# EAGLE design DOG_DisplayBreakout (EAGLE 7.3.0)
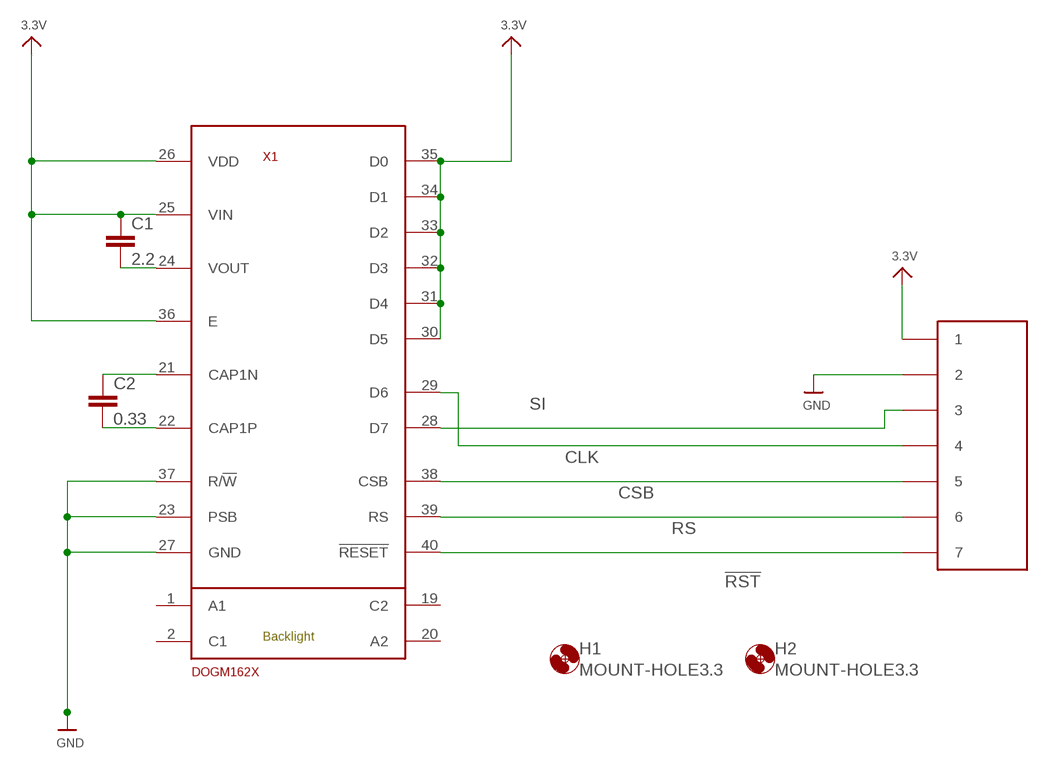
[diagram p0: schematic, sheet 1]

## Parts
C1  2.2  CAPACITOR0805  [0805_BIGGERPAD-OK]
C2  0.33  CAPACITOR0805  [0805_BIGGERPAD-OK]
CN1  JST_S7B-PH-K-S  [JST_S7B-PH-K-S]
H1  MOUNT-HOLE3.3  [HOLE3,3]
H2  MOUNT-HOLE3.3  [HOLE3,3]
X1  DOGM162X  [DOGM162X]

## Nets
3.3V: C1.1 CN1.P1 X1.25(VIN) X1.26(VDD) X1.30(D5) X1.31(D4) X1.32(D3) X1.33(D2) X1.34(D1) X1.35(D0) X1.36(E)
!RST: CN1.P7 X1.40(!RESET)
CLK: CN1.P4 X1.29(D6)
CSB: CN1.P5 X1.38(CSB)
GND: CN1.P2 X1.23(PSB) X1.27(GND) X1.37(R/!W)
N$1: C1.2 X1.24(VOUT)
N$2: C2.1 X1.21(CAP1N)
N$3: C2.2 X1.22(CAP1P)
RS: CN1.P6 X1.39(RS)
SI: CN1.P3 X1.28(D7)
Unconnected: X1.1(A1) X1.2(C1) X1.19(C2) X1.20(A2)

## Library data of the parts
C1 C2 = DMF-Bigger_SMD_footprints:CAPACITOR: Capacitor Standard 0603 ceramic capacitor, and 0.1" leaded capacitor.
CN1 = DMF-Additional_Supply_dmf:JST_S7B-PH-K-S
H1 H2 = DMF-Audio_Connectors:MOUNT-HOLE: MOUNTING HOLE with drill center marker
X1 = DMF_Displays:DOGM162X: DOGM Character Display http://www.lcd-module.com/products/dog.html

## Board
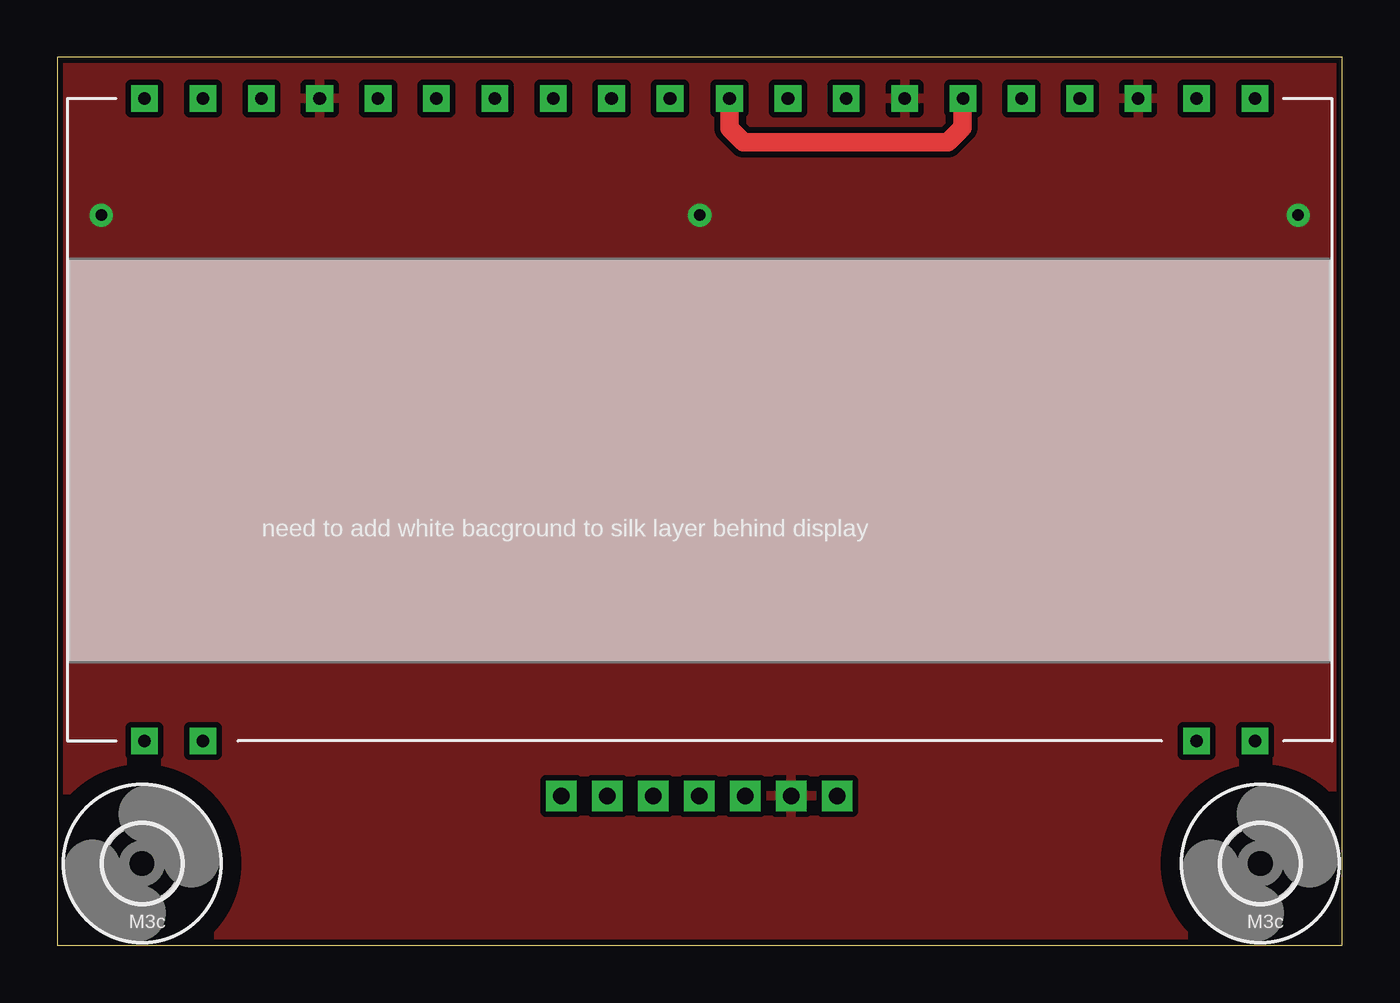
[diagram p1: board, top side]
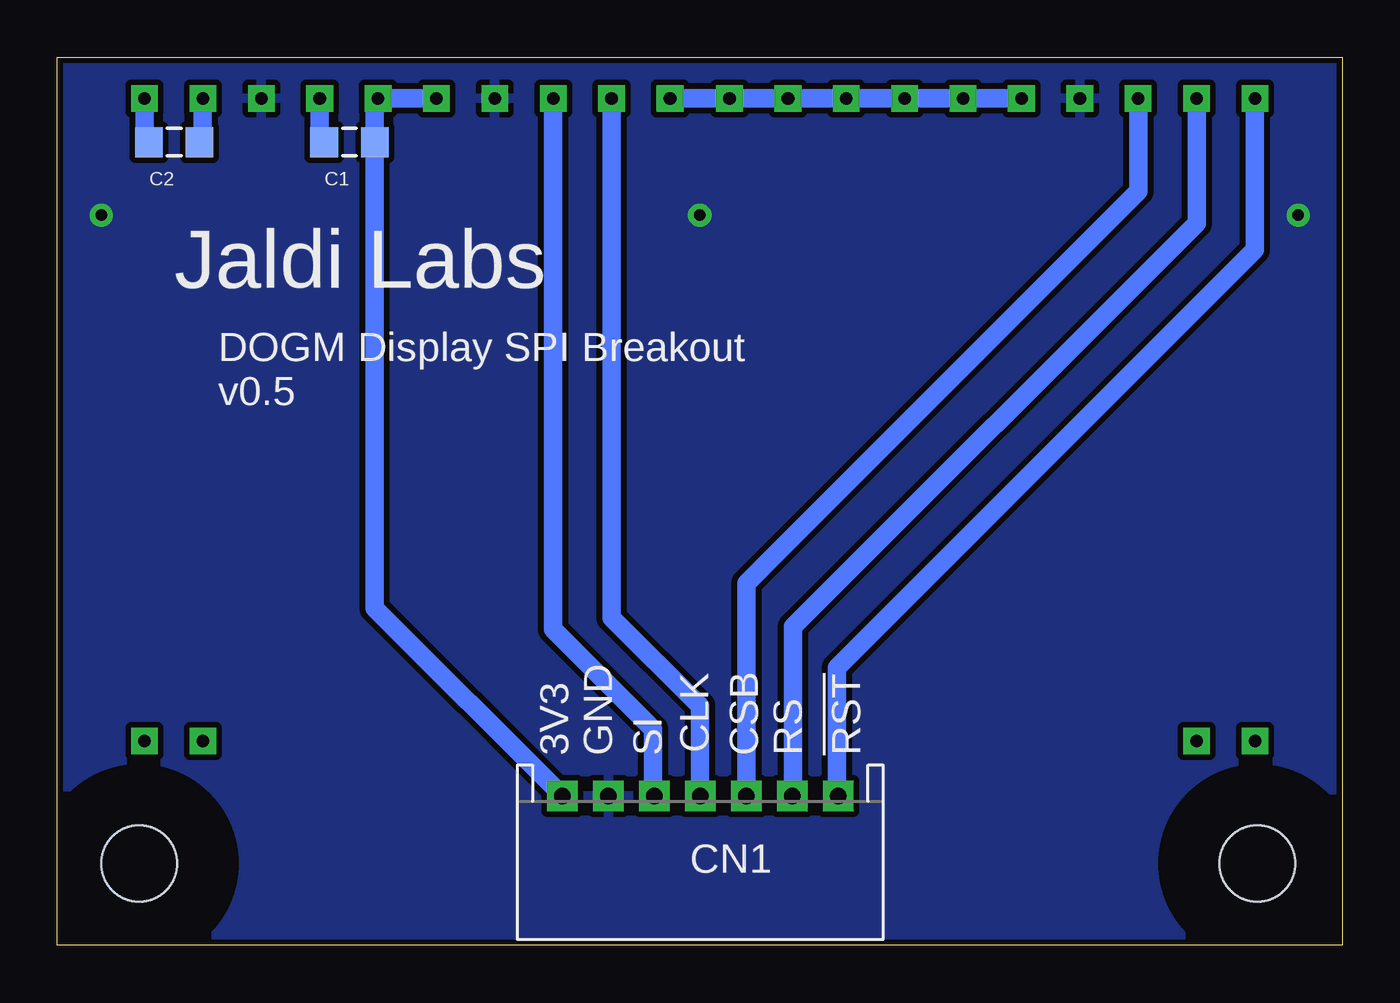
[diagram p2: board, bottom side, seen from below]

Size 55.88 x 38.61 mm. Coordinates in mm from the lower left corner, seen from the top.
Outline: 0,0 55.88,0 55.88,38.61 0,38.61 0,0
Copper layers (1*16): Top 0.035mm / dielectric 1.5mm / Bottom 0.035mm
Design rules "SparkFun-2-layer": minimum track width 7mil, minimum drill 15mil, track to track 8mil, track to pad 8mil, pad to pad 8mil, via to via 8mil, smd to smd 8mil, copper to edge 8mil, drill to drill 8mil, minimum pad ring 12mil, minimum via ring 10mil, stop-mask expansion 4mil, vias tented up to drill 20mil, thermal gap 10mil

### Footprints (pad centres in the part's own frame; a part is rotated, then mirrored left to right if it is on the bottom)
0805_BIGGERPAD-OK = smd 1.2 x 1.3: 1 -1.1,0; 2 1.1,0
JST_S7B-PH-K-S = drill 0.7 square: P1 1.96,6.24; P2 3.96,6.24; P3 5.96,6.24; P4 7.96,6.24; P5 9.96,6.24; P6 11.96,6.24; P7 13.96,6.24
HOLE3,3 = hole 3.3: 0,0
DOGM162X = drill 0.55 square: 1 -24.155,-13.97; 2 -21.615,-13.97; 19 21.615,-13.97; 20 24.155,-13.97; 21 24.155,13.97; 22 21.615,13.97; 23 19.075,13.97; 24 16.535,13.97; 25 13.995,13.97; 26 11.455,13.97; 27 8.915,13.97; 28 6.375,13.97; 29 3.835,13.97; 30 1.295,13.97; 31 -1.295,13.97; 32 -3.835,13.97; 33 -6.375,13.97; 34 -8.915,13.97; 35 -11.455,13.97; 36 -13.995,13.97; 37 -16.535,13.97; 38 -19.075,13.97; 39 -21.615,13.97; 40 -24.155,13.97

### Placement (x,y rotation side)
C1  43.18,34.92 180 bottom
C2  50.8,34.92 0 bottom
CN1  35.88,0.25 0 bottom
H1  3.68,3.56 0 top
H2  52.32,3.56 0 top
X1  27.94,22.86 0 top

### Tracks (layer width: path | path; a pad name or v marks a point on that pad's centre or on a via)
3.3V
  Top 0.813: 42.08,36.69 X1.25 | X1.30 29.23,35.53 29.84,34.92 38.73,34.92 39.37,35.56 39.37,36.8 X1.26
  Bottom 0.813: X1.30 X1.31 X1.32 X1.33 X1.34 X1.35 X1.36 | X1.26 X1.25 42.08,36.69 C1.1 42.08,14.66 CN1.P1
!RST
  Bottom 0.813: X1.40 3.79,30.25 21.97,12.06 21.97,6.55 CN1.P7
CLK
  Bottom 0.813: X1.29 31.77,14.25 27.94,10.41 27.94,6.52 CN1.P4
CSB
  Bottom 0.813: X1.38 8.87,32.79 25.91,15.75 25.91,6.5 CN1.P5
GND  (via drill 0.5)
  other vias: 27.94,31.75 53.98,31.75 1.91,31.75
  pour Bottom (isolate 0.254): -1.91,44.45 59.69,43.81 59.69,-2.54 -2.54,-2.54
  pour Top (isolate 0.254): -2.54,45.09 59.05,43.81 58.42,-1.91 -2.54,-2.54
N$1
  Bottom 0.813: X1.24 44.48,35.12 C1.2
N$2
  Top 0.813: 52.07,36.85 X1.21
  Bottom 0.813: X1.21 52.09,35.12 C2.1
N$3
  Bottom 0.813: X1.22 49.55,35.07 C2.2
RS
  Bottom 0.813: X1.39 6.33,31.39 23.88,13.84 23.88,6.54 CN1.P6
SI
  Bottom 0.813: X1.28 34.31,13.74 29.97,9.4 29.97,6.55 CN1.P3

### Text on the board
bNames: Jaldi Labs | DOGM Display SPI Breakout / v0.5 | !RST | RS | CSB | CLK | SI | GND | 3V3